# Altium project PCB_Project1.PrjPCB
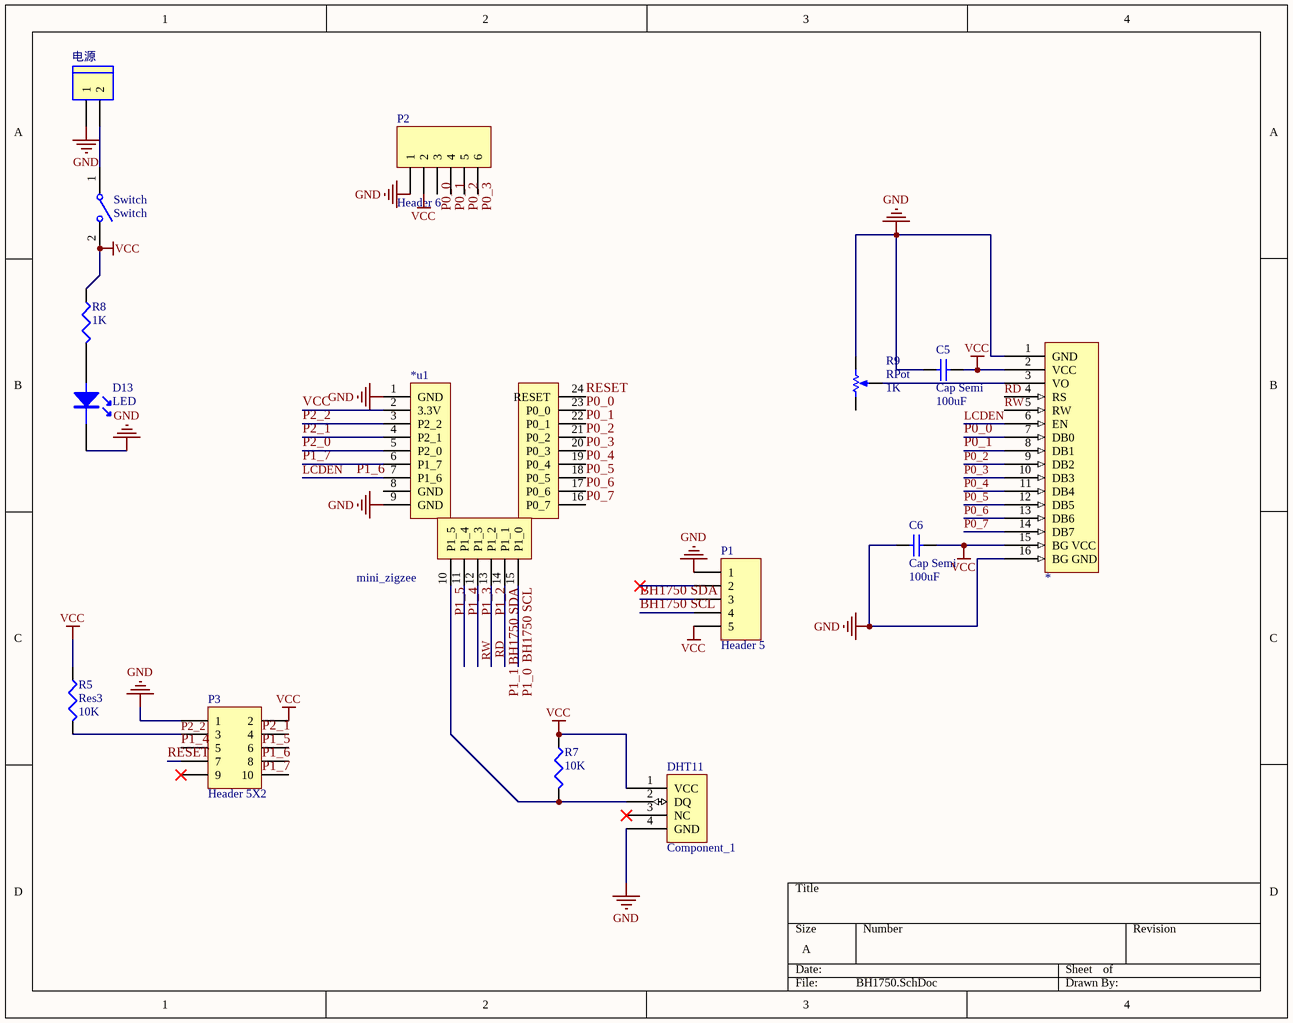
[diagram p0: BH1750.SchDoc]
1 sheet, 15 parts. Net scope: global (net labels, ports and power ports of the same name join across sheets).
Board file: BH1750.PcbDoc

## Sheet BH1750.SchDoc
size A

### Parts
*  Component_1  [HDR1X16]  (value not drawn)
*u1  mini_zigzee  [mini_zigbee]
C5  Cap Semi  value 100uF  [C1206]
C6  Cap Semi  value 100uF  [C1206]
D13  LED  [LED]
DHT11  Component_1  [HDR1X4]
P1  Header 5  [HDR1X5]
P2  Header 6  [HDR1X6]
P3  Header 5X2  [HDR2X5]
R5  Res3  value 10K  [J1-0603]
R7  value 10K  [J1-0603]  (hidden comment: Res3)
R8  value 1K  [J1-0603]  (hidden comment: Res3)
R9  RPot  value 1K  [TO-205AF]
Switch  Switch  [Switch]
电源  (no value)  [HDR1X2]

### Nets
GND: *.1(GND) *.16(BG_GND) *u1.1(GND) *u1.9(GND) C5.1 C6.1 D13.K DHT11.4(GND) P1.1 P2.1 P3.1 R9.2(BOT) 电源.1
VCC: *.2(VCC) *.15(BG_VCC) *u1.2(3.3V) C5.2 C6.2 DHT11.1(VCC) P1.5 P2.2 P3.2 R5.1 R7.1 R8.1 Switch.2(NO)
BH1750 SCL: *u1.15(P1_0) P1.4  [also labelled P1_0]
BH1750 SDA: *u1.14(P1_1) P1.3  [also labelled P1_1]
LCDEN: *.6(EN) *u1.7(P1_6)  [also labelled P1_6]
P0_0: *.7(DB0) *u1.23(P0_0)
P0_1: *.8(DB1) *u1.22(P0_1)
P0_2: *.9(DB2) *u1.21(P0_2)
P0_3: *.10(DB3) *u1.20(P0_3)
P0_4: *.11(DB4) *u1.19(P0_4)
P0_5: *.12(DB5) *u1.18(P0_5)
P0_6: *.13(DB6) *u1.17(P0_6)
P0_7: *.14(DB7) *u1.16(P0_7)
P1_2: *.4(RS) *u1.13(P1_2)  [also labelled RD]
P1_3: *.5(RW) *u1.12(P1_3)  [also labelled RW]
P1_4: *u1.11(P1_4) P3.5
P1_5: *u1.10(P1_5) DHT11.2(DQ) R7.2
P1_7: *u1.6(P1_7)
P2_0: *u1.5(P2_0)
P2_1: *u1.4(P2_1)
P2_2: *u1.3(P2_2) P3.3 R5.2
RESET: *u1.24(RESET) P3.7
Net*_3: *.3(VO) R9.3(TAP)
NetD13_A: D13.A R8.2
NetSwitch_1: Switch.1(COMMON) 电源.2

Not connected (* = marked no-connect by the designer): *u1 8(GND); DHT11 3(NC)*; P1 2*; P2 3 4 5 6; P3 4 6 8 9* 10; R9 1(TOP)

### Notes on the sheet
- Labels drawn without touching a wire or pin: P0_0, P0_1, P0_2, P0_3, P1_5, P1_6, P1_7, P2_1

### Library data of the parts
C5 C6 = Cap Semi: Capacitor (Semiconductor SIM Model); Published: 8-Jun-2000; LatestRevisionDate: 29-May-2009; LatestRevisionNote: IPC-7351 Footprint Added.; PackageReference: C1206; Publisher: Altium Limited; PackageDescription: Chip Capacitor
D13 = LED_1
P1 = Header 5: Header, 5-Pin; LatestRevisionDate: 17-Jul-2002; LatestRevisionNote: Re-released for DXP Platform.; Publisher: Altium Limited
P2 = Header 6: Header, 6-Pin; LatestRevisionDate: 17-Jul-2002; LatestRevisionNote: Re-released for DXP Platform.; Publisher: Altium Limited
P3 = Header 5X2: Header, 5-Pin, Dual row; LatestRevisionDate: 17-Jul-2002; LatestRevisionNote: Re-released for DXP Platform.; Publisher: Altium Limited
R5 R7 R8 = Res3: Resistor; Published: 8-Jun-2000; LatestRevisionDate: 29-May-2009; LatestRevisionNote: IPC-7351 Footprint Added.; PackageReference: J1-0603; Publisher: Altium Limited; PackageDescription: Chip Resistor
R9 = RPot: Potentiometer; Sim Note: Enter the Resistance value and the set point into parameter fields.; Set Position: 0.5; Published: 8-Jun-2000; LatestRevisionDate: 17-Jul-2002; LatestRevisionNote: Re-released for DXP Platform.; PackageReference: VR5; Publisher: Altium Limited; PackageDescription: Variable Resistor, Thru-Hole; 3 Leads
电源 = H-2: Header, 2-Pin; Manufacturer: Generic Components; Class: Connector